# EAGLE design circuitdraft (EAGLE 9.5.2)
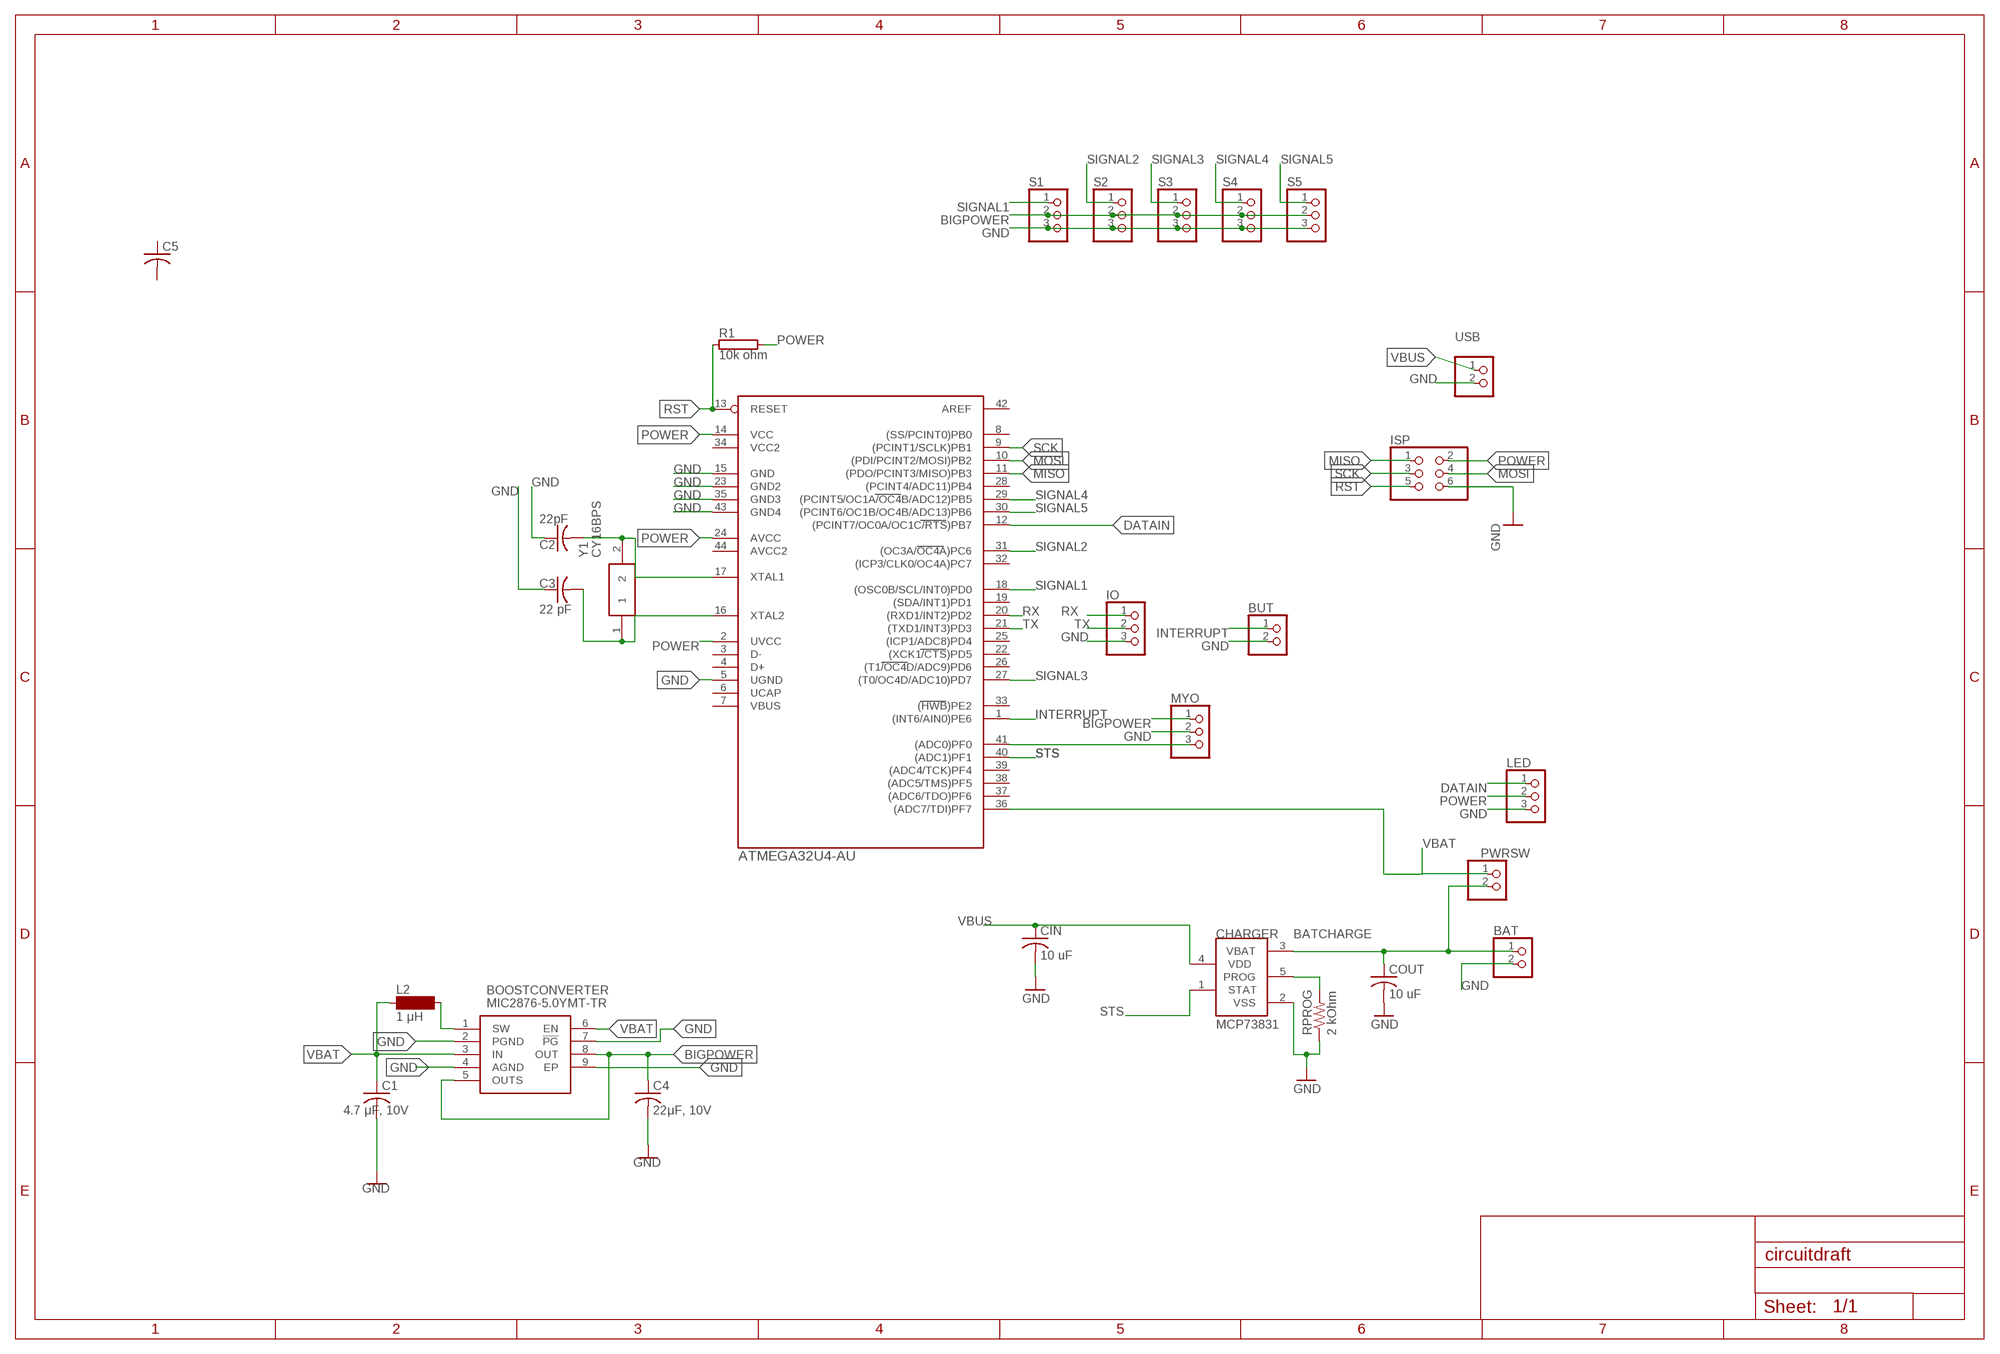
[diagram p0: schematic, sheet 1]

## Parts
BAT  PINHD-1X2  [1X02]
BOOSTCONVERTER  MIC2876-5.0YMT-TR  [MIC287650YMTTR]
BUT  PINHD-1X2  [1X02]
C1  4.7 μF, 10V  C-USC0603  [C0603]
C2  22pF  C-US025-024X044  [C025-024X044]
C3  22 pF  C-US025-024X044  [C025-024X044]
C4  22μF, 10V  C-USC0603  [C0603]
C5  C-USC0603  [C0603]
CHARGER  MCP73831  [SOT23-5L]
CIN  10 uF  C-USC0603  [C0603]
COUT  10 uF  C-USC0603  [C0603]
IO  PINHD-1X3  [1X03]
ISP  PINHD-2X3  [2X03]
L2  1 μH  SD75  [SD75]
LED  PINHD-1X3  [1X03]
MYO  PINHD-1X3  [1X03]
PWRSW  PINHD-1X2  [1X02]
R1  10k ohm  RRS1/8  [RS1/8]
RPROG  2 kOhm  R-US_R0603  [R0603]
S1  PINHD-1X3  [1X03]
S2  PINHD-1X3  [1X03]
S3  PINHD-1X3  [1X03]
S4  PINHD-1X3  [1X03]
S5  PINHD-1X3  [1X03]
U$1  ATMEGA32U4-AU  [TQFP44]
USB  PINHD-1X2  [1X02]
Y1  CY16BPS  [CY16BPS]

## Nets
BATCHARGE [power]: BAT.1 CHARGER.3(VBAT) COUT.1 PWRSW.2
BIGPOWER [power]: BOOSTCONVERTER.5(OUTS) BOOSTCONVERTER.8(OUT) C4.1 MYO.1 S1.2 S2.2 S3.2 S4.2 S5.2
DATAIN: LED.1 U$1.12((PCINT7/OC0A/OC1C/RTS)PB7)
GND: BAT.2 BOOSTCONVERTER.2(PGND) BOOSTCONVERTER.4(AGND) BOOSTCONVERTER.7(!PG) BOOSTCONVERTER.9(EP) BUT.2 C1.2 C2.1 C3.1 C4.2 CHARGER.2(VSS) CIN.2 COUT.2 IO.3 ISP.6 LED.3 MYO.2 RPROG.1 S1.3 S2.3 S3.3 S4.3 S5.3 U$1.5(UGND) U$1.15(GND) U$1.23(GND2) U$1.35(GND3) U$1.43(GND4) USB.2
INTERRUPT: BUT.1 U$1.1((INT6/AIN0)PE6)
MISO: ISP.1 U$1.11((PDO/PCINT3/MISO)PB3)
MOSI: ISP.4 U$1.10((PDI/PCINT2/MOSI)PB2)
N$1: MYO.3 U$1.41((ADC0)PF0)
N$3: BOOSTCONVERTER.1(SW) L2.2
N$4: CHARGER.5(PROG) RPROG.2
N$5: C2.2 U$1.17(XTAL1) Y1.2
N$6: C3.2 U$1.16(XTAL2) Y1.1
POWER: ISP.2 LED.2 R1.2 U$1.2(UVCC) U$1.14(VCC) U$1.24(AVCC)
RST: ISP.5 R1.1 U$1.13(RESET)
RX: IO.1 U$1.20((RXD1/INT2)PD2)
SCK: ISP.3 U$1.9((PCINT1/SCLK)PB1)
SIGNAL1: S1.1 U$1.18((OSC0B/SCL/INT0)PD0)
SIGNAL2: S2.1 U$1.31((OC3A/OC4A)PC6)
SIGNAL3: S3.1 U$1.27((T0/OC4D/ADC10)PD7)
SIGNAL4: S4.1 U$1.29((PCINT5/OC1A/OC4B/ADC12)PB5)
SIGNAL5: S5.1 U$1.30((PCINT6/OC1B/OC4B/ADC13)PB6)
STS: CHARGER.1(STAT) U$1.40((ADC1)PF1)
TX: IO.2 U$1.21((TXD1/INT3)PD3)
VBAT [power]: BOOSTCONVERTER.3(IN) BOOSTCONVERTER.6(EN) C1.1 L2.1 PWRSW.1 U$1.36((ADC7/TDI)PF7)
VBUS: CHARGER.4(VDD) CIN.1 USB.1
Unconnected: C5.1 C5.2 U$1.3(D-) U$1.4(D+) U$1.6(UCAP) U$1.7(VBUS) U$1.8((SS/PCINT0)PB0) U$1.19((SDA/INT1)PD1) U$1.22((XCK1/CTS)PD5) U$1.25((ICP1/ADC8)PD4) U$1.26((T1/OC4D/ADC9)PD6) U$1.28((PCINT4/ADC11)PB4) U$1.32((ICP3/CLK0/OC4A)PC7) U$1.33((HWB)PE2) U$1.34(VCC2) U$1.37((ADC6/TDO)PF6) U$1.38((ADC5/TMS)PF5) U$1.39((ADC4/TCK)PF4) U$1.42(AREF) U$1.44(AVCC2)

## Library data of the parts
BAT BUT PWRSW USB = pinhead:PINHD-1X2: PIN HEADER
BOOSTCONVERTER = 3DPC:MIC2876-5.0YMT-TR: Switching Voltage Regulators Source: Datasheet <https://componentsearchengine.com/Datasheets/1/MIC2876-5.0YMT-TR.pdf>; DESCRIPTION: Switching Voltage Regulators; HEIGHT: 0.6mm; MANUFACTURER_NAME: Microchip; MANUFACTURER_PART_NUMBER: MIC2876-5.0YMT-TR; MOUSER_PART_NUMBER: 998-MIC2876-50YMTTR; MOUSER_PRICE-STOCK: https://www.mouser.com/Search/Refine.aspx?Keyword=998-MIC2876-50YMTTR
C1 C4 C5 CIN COUT = 3DPC:C-US: CAPACITOR, American symbol; SPICEPREFIX: C
C2 C3 = rcl:C-US: CAPACITOR, American symbol; SPICEPREFIX: C
CHARGER = 3DPC:MCP73831: Miniature Single-Cell, Fully Integrated Li-Ion, Li-Polymer Charge Management Controllers
IO LED MYO S1-S5 = pinhead:PINHD-1X3: PIN HEADER
ISP = pinhead:PINHD-2X3: PIN HEADER
L2 = inductor-neosid:SD75: INDUCTOR nominal inductance, E12; OC_FARNELL: unknown; OC_NEWARK: unknown
R1 = resistor-power:R: Power Resitor; OC_FARNELL: unknown; OC_NEWARK: unknown
RPROG = 3DPC:R-US_: RESISTOR, American symbol; SPICEPREFIX: R
U$1 = mega32U4:ATMEGA32U4-AU
Y1 = SamacSys_Parts:CY16BPS: Crystals 16MHz 20pF 0C +70C Source: Datasheet <https://componentsearchengine.com/Datasheets/1/CY16BPS.pdf>; DESCRIPTION: Crystals 16MHz 20pF 0C +70C; HEIGHT: 5mm; MANUFACTURER_NAME: Crystek; MANUFACTURER_PART_NUMBER: CY16BPS; MOUSER_PART_NUMBER: 549-CY16BPS; MOUSER_PRICE-STOCK: https://www.mouser.com/Search/Refine.aspx?Keyword=549-CY16BPS

## Net classes
1 power: width 0.1 mm

## Board
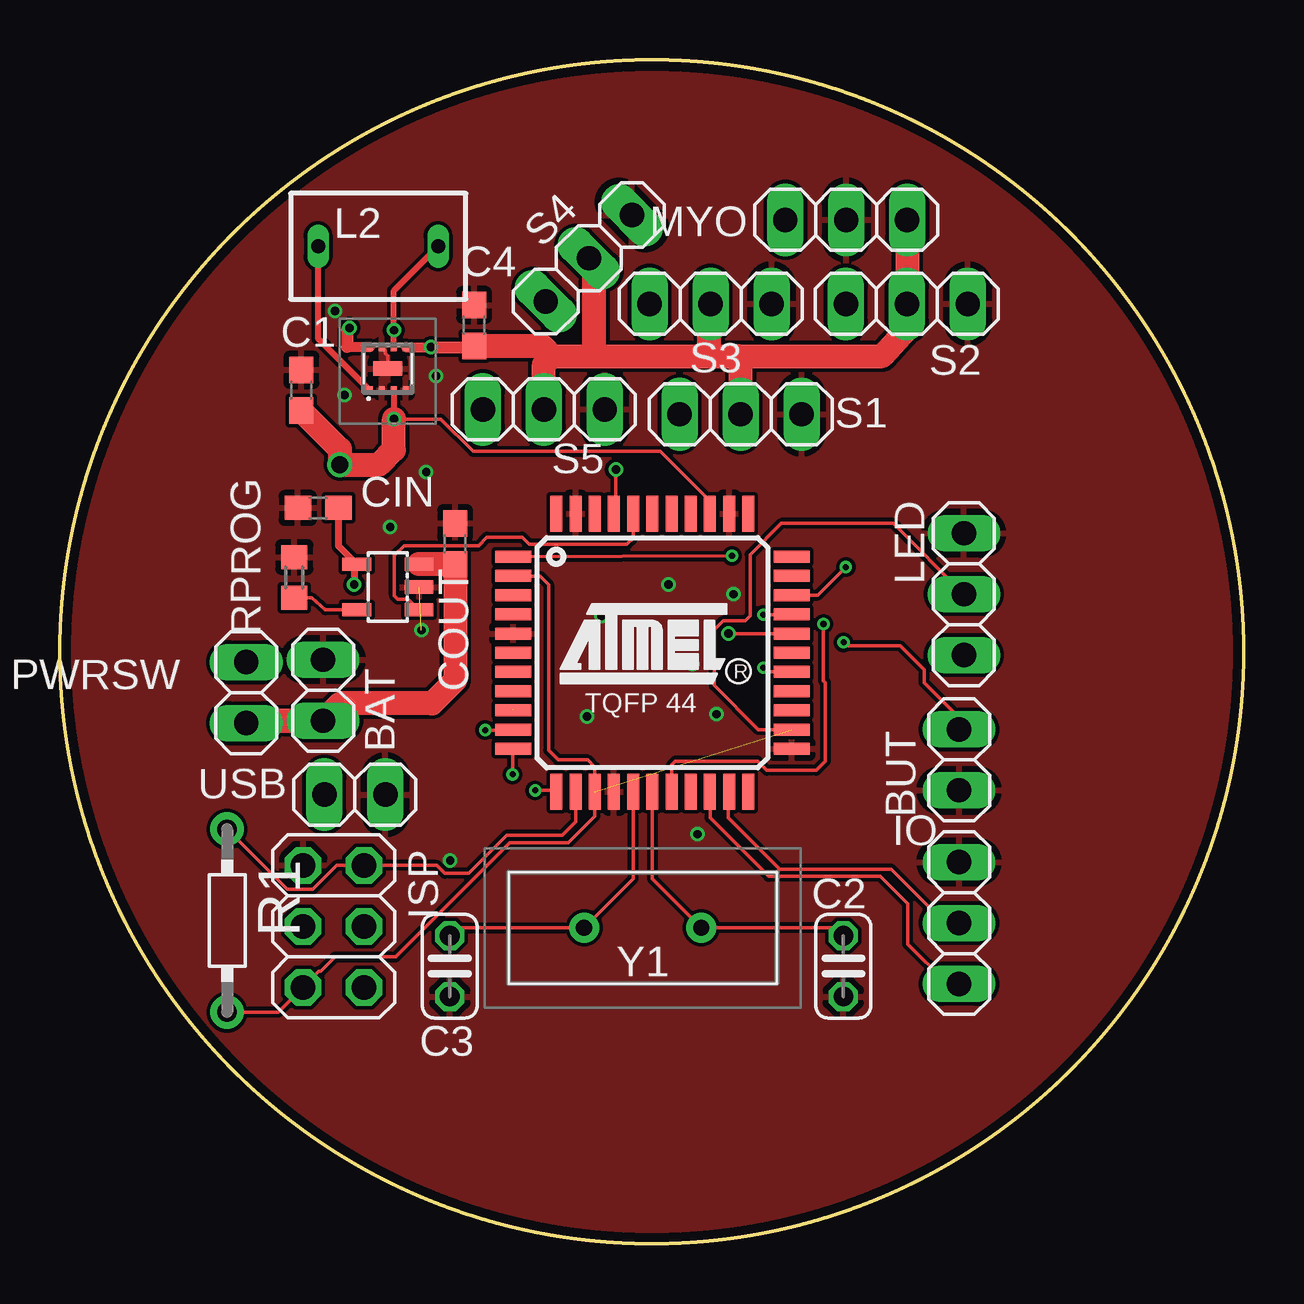
[diagram p1: board, top side]
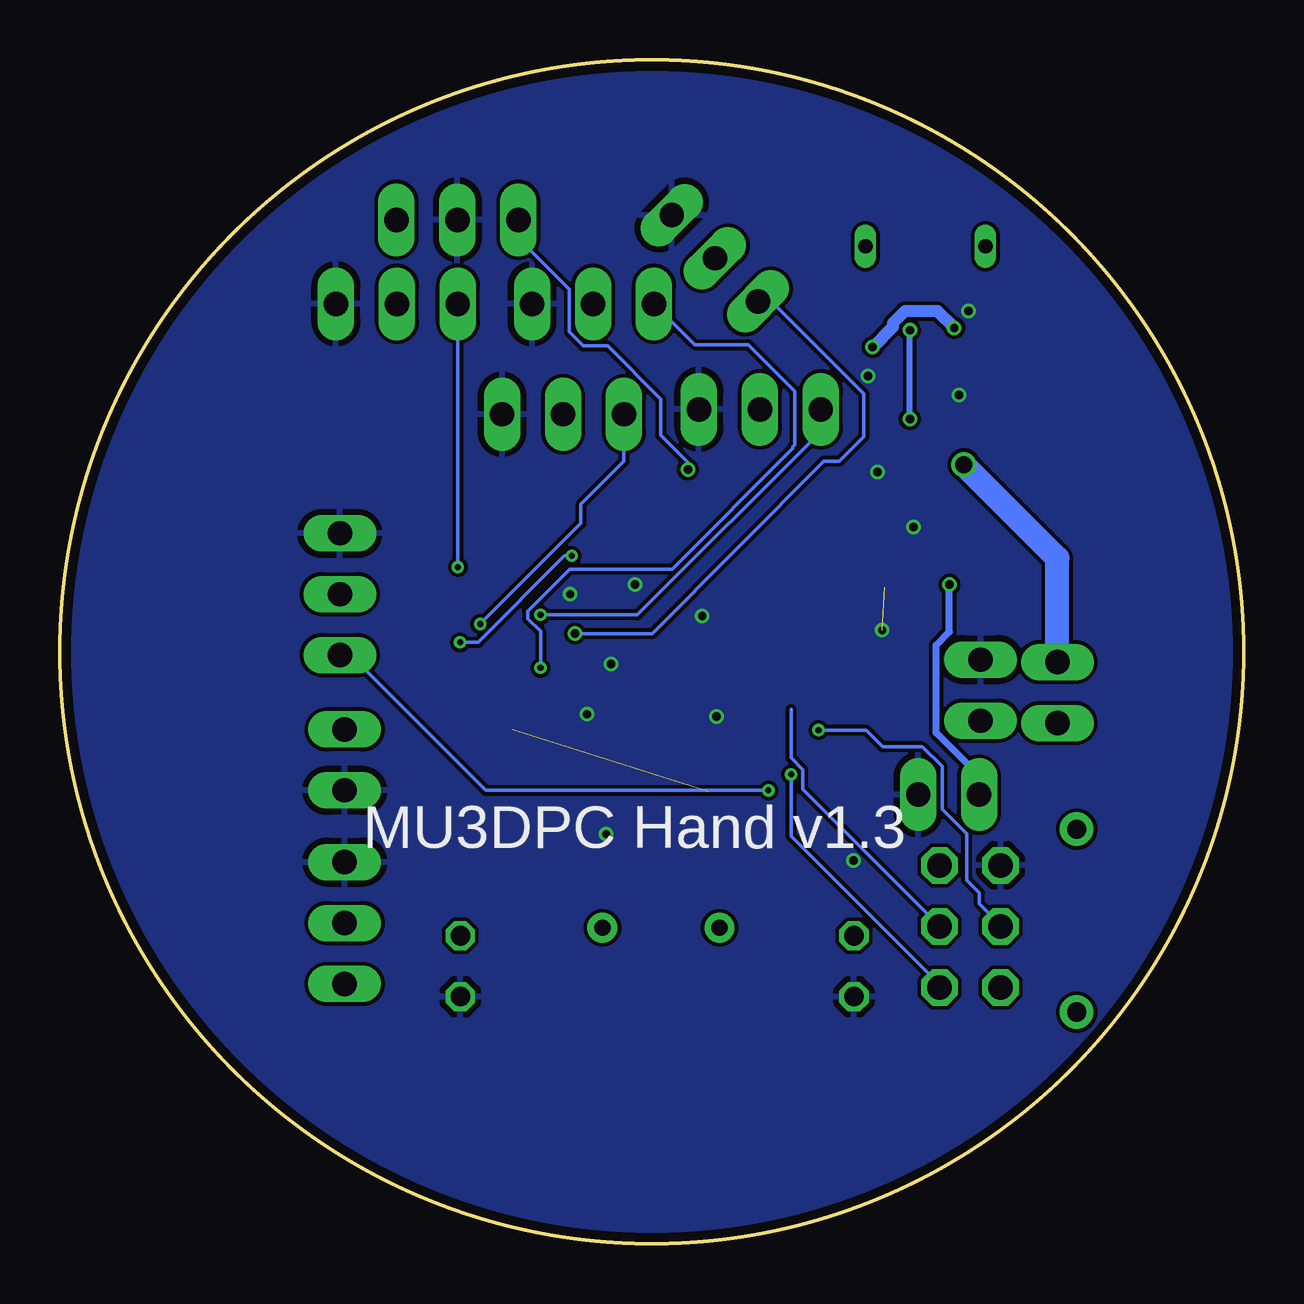
[diagram p2: board, bottom side, seen from below]

Size 49.32 x 49.32 mm. Coordinates in mm from the lower left corner, seen from the top.
Outline: circle at 24.66,24.66 radius 24.66
Copper layers (1*16): Top 0.035559375mm / dielectric 1.6mm / Bottom 0.035559375mm
Design rules "oshpark-2layer *": minimum track width 6mil, minimum drill 10mil, track to track 6mil, track to pad 6mil, pad to pad 6mil, via to via 6mil, smd to smd 6mil, copper to edge 15mil, drill to drill 6mil, minimum pad ring 5mil, minimum via ring 5mil, stop-mask expansion 2.5mil, vias tented up to drill 30mil, thermal gap 10mil

### Footprints (pad centres in the part's own frame; a part is rotated, then mirrored left to right if it is on the bottom)
1X02 = drill 1.016 long: 1 -1.27,0; 2 1.27,0
MIC287650YMTTR = smd 0.25 x 0.35: 1 -0.75,-0.9; 2 -0.25,-0.9; 3 0.25,-0.9; 4 0.75,-0.9; 5 0.75,0.9; 6 0.25,0.9; 7 -0.25,0.9; 8 -0.75,0.9 | smd 1.2 x 0.6: 9 0,0
C0603 = smd 1.1 x 1: 1 -0.85,0; 2 0.85,0
C025-024X044 = drill 0.813 octagon: 1 -1.27,0; 2 1.27,0
SOT23-5L = smd 0.55 x 1.2: 1 -0.95,-1.3; 2 0,-1.3; 3 0.95,-1.3; 4 0.95,1.3; 5 -0.95,1.3
1X03 = drill 1.016 long: 1 -2.54,0; 2 0,0; 3 2.54,0
2X03 = drill 1.016 octagon: 1 -2.54,-1.27; 2 -2.54,1.27; 3 0,-1.27; 4 0,1.27; 5 2.54,-1.27; 6 2.54,1.27
SD75 = drill 0.6 long: 1 -2.5,0; 2 2.5,0
RS1/8 = drill 0.8 pad 1.4: 1 -3.81,0; 2 3.81,0
R0603 = smd 1 x 1.1: 1 -0.85,0; 2 0.85,0
TQFP44 = smd 1.5 x 0.5: 1 -5.8,4; 2 -5.8,3.2; 3 -5.8,2.4; 4 -5.8,1.6; 5 -5.8,0.8; 6 -5.8,0; 7 -5.8,-0.8; 8 -5.8,-1.6; 9 -5.8,-2.4; 10 -5.8,-3.2; 11 -5.8,-4; 23 5.8,-4; 24 5.8,-3.2; 25 5.8,-2.4; 26 5.8,-1.6; 27 5.8,-0.8; 28 5.8,0; 29 5.8,0.8; 30 5.8,1.6; 31 5.8,2.4; 32 5.8,3.2; 33 5.8,4 | smd 0.5 x 1.5: 12 -4,-5.8; 13 -3.2,-5.8; 14 -2.4,-5.8; 15 -1.6,-5.8; 16 -0.8,-5.8; 17 0,-5.8; 18 0.8,-5.8; 19 1.6,-5.8; 20 2.4,-5.8; 21 3.2,-5.8; 22 4,-5.8; 34 4,5.8; 35 3.2,5.8; 36 2.4,5.8; 37 1.6,5.8; 38 0.8,5.8; 39 0,5.8; 40 -0.8,5.8; 41 -1.6,5.8; 42 -2.4,5.8; 43 -3.2,5.8; 44 -4,5.8
CY16BPS = drill 0.68 pad 1.247: 1 -2.44,0; 2 2.44,0

### Placement (x,y rotation side)
BAT  10.96,23.06 90 top
BOOSTCONVERTER  13.66,36.46 0 top
BUT  37.46,20.16 270 top
C1  10.06,35.56 90 top
C2  32.64,11.56 90 top
C3  16.24,11.56 90 top
C4  17.26,38.26 90 top
C5  -4.54,-3.24 0 top  (outside the outline)
CHARGER  13.66,27.36 90 top
CIN  10.76,30.66 180 top
COUT  16.46,29.16 90 top
IO  37.46,13.36 90 top
ISP  11.4,13.22 90 top
L2  13.26,41.56 180 top
LED  37.66,27.06 90 top
MYO  32.76,42.66 180 top
PWRSW  7.76,22.96 270 top
R1  6.96,13.46 270 top
RPROG  9.76,27.76 270 top
S1  28.36,34.56 0 top
S2  35.28,39.16 0 top
S3  27.11,39.16 0 top
S4  22.03,41.06 45 top
S5  20.16,34.76 0 top
U$1  24.68,24.62 0 top
USB  12.29,18.71 0 top
Y1  24.28,13.16 0 top

### Tracks (layer width: path | path; a pad name or v marks a point on that pad's centre or on a via)
BATCHARGE
  Top 1: CHARGER.3 COUT.1 16.46,23.47 15.51,22.52 11.69,22.52 BAT.1
  Top 1.016: BAT.1 7.86,21.79 PWRSW.2
BIGPOWER  (via drill 0.35)
  Top 0.152: 17.23,37.38 C4.1
  Top 0.406: BOOSTCONVERTER.8 11.96,37.36 | BOOSTCONVERTER.5 v15.46,37.36
  Top 0.508: v12.06,38.16 11.96,38.06 11.96,37.36 | v15.46,37.36 17.21,37.36 17.23,37.38
  Top 1: 28.26,36.98 34.26,36.98 35.28,38.11 S2.2 35.31,39.09 35.31,42.65 MYO.1 | C4.1 20.09,37.41 20.52,36.98 | 20.52,36.98 22.26,36.98 | 22.26,36.98 27.06,36.98 | 27.06,36.98 28.26,36.98 | S5.2 20.16,36.62 20.52,36.98 | S1.2 28.36,36.88 28.26,36.98 | 27.06,36.98 27.06,39.11 S3.2 | 22.26,36.98 22.26,40.83 S4.2
  Bottom 0.508: v12.06,38.16 12.76,38.86 14.11,38.86 14.62,38.35 14.62,38.2 v15.46,37.36
DATAIN  (via drill 0.25)
  Top 0.152: v19.8,18.88 20.61,18.88 U$1.12
  Bottom 0.152: v19.8,18.88 31.58,18.88 37.15,24.45 37.6,24.45 LED.1
GND  (via drill 0.35)  (1 unrouted)
  Top 0.152: BOOSTCONVERTER.7 13.55,37.22 13.55,37.09 13.66,36.99 BOOSTCONVERTER.9
  other vias: 28.06,27.06 25.36,27.46 21.96,21.96 15.26,32.16 13.76,29.86 15.06,25.56 16.26,15.96 26.56,17.06 26.36,24.16 27.36,22.06 22.56,26.16 11.46,38.86 11.86,35.36 15.66,36.16
  pour Top: -3.74,64.96 51.36,64.96 51.36,-0.64 -3.74,-0.64
  pour Bottom: -5.94,67.66 50.46,67.66 50.46,-1.24 -5.94,-1.24
INTERRUPT  (via drill 0.25)
  Top 0.152: v32.65,25.06 32.8,24.9 35.01,24.9 36,23.91 36,23.38 37.45,21.93 37.45,21.48 BUT.1 | v28,28.66 27.98,28.66 U$1.1
  Bottom 0.152: v28,28.66 28.31,28.66 31.89,25.06 v32.65,25.06
MISO  (via drill 0.25)
  Top 0.152: v18.86,19.55 18.86,20.56 U$1.11
  Bottom 0.152: v18.86,19.55 18.86,16.98 12.61,10.73 ISP.1
MOSI  (via drill 0.25)
  Top 0.152: v17.71,21.4 18.86,21.4 U$1.10
  Bottom 0.152: ISP.4 10.09,13.25 11.01,14.16 11.01,14.62 11.54,15.15 11.54,17.07 12.57,18.1 12.57,19.88 13.39,20.7 15.03,20.7 15.73,21.4 v17.71,21.4
N$1  (via drill 0.35)
  Top 0.152: U$1.41 23.05,30.47 23.16,30.58 v23.16,32.26
  Bottom 0.152: MYO.3 30.22,41.89 28.1,39.77 28.1,37.99 27.52,37.41 26.5,37.41 24.29,35.19 24.29,33.69 23.16,32.56 v23.16,32.26
N$3
  Top 0.254: BOOSTCONVERTER.1 10.76,37.71 L2.2
N$4
  Top 0.152: CHARGER.5 11.06,26.41 10.48,26.91 RPROG.2
N$5
  Top 0.152: U$1.17 24.68,15.2 Y1.2 32.31,13.16 C2.2
N$6
  Top 0.152: C3.2 16.57,13.16 Y1.1 23.88,15.2 U$1.16
POWER  (1 unrouted)
  Top 0.152: U$1.2 18.93,27.8 20.02,27.8 20.36,27.46 20.36,20.56 20.76,20.16 21.99,20.16 22.29,19.86 22.29,18.88 U$1.14 22.29,18.81 22.29,17.82 21.18,16.71 18.74,16.71 13.98,11.95 11.47,11.95 10.86,11.34 10.78,11.34 10.17,10.73 ISP.2 9.1,9.65 R1.2 | LED.2 34.71,30.01 30.06,30.01 28.76,28.71 28.76,26.16 28.55,25.95 27.64,25.95 27.26,25.57 27.26,23.26 29.1,21.42 U$1.24
RST
  Top 0.152: U$1.13 21.48,17.58 20.92,17.02 18.62,17.02 17.03,15.43 16.04,15.43 15.71,15.76 12.69,15.76 ISP.5 11.53,15.76 10.54,14.77 9.46,14.77 R1.1
RX
  Top 0.152: U$1.20 27.09,18.81 27.09,17.74 29.53,15.3 34.17,15.3 35.32,14.16 35.32,12.48 36.92,10.88 37.45,10.88 IO.1
SCK  (1 unrouted)
  Top 0.152: 18.86,22.24 U$1.9
  Bottom 0.152: 18.86,22.26 18.86,20.24 18.37,19.75 18.37,18.92 ISP.3
SIGNAL1  (via drill 0.25)
  Top 0.152: v31.81,25.82 31.81,23.46 31.89,23.38 31.89,20.1 31.51,19.72 29.45,19.72 29.07,20.1 25.64,20.1 25.49,19.95 25.49,18.88 U$1.18
  Bottom 0.152: v31.81,25.82 27.62,30.01 27.62,30.8 25.82,32.6 S1.1
SIGNAL2  (via drill 0.25)
  Top 0.152: U$1.31 31.57,27.02 v32.74,28.19
  Bottom 0.152: S2.1 v32.74,28.19
SIGNAL3  (via drill 0.25)
  Top 0.152: v29.3,23.99 29.45,23.84 30.44,23.84 U$1.27
  Bottom 0.152: v29.3,23.99 29.3,25.51 29.83,26.05 29.83,26.35 28.08,28.11 23.81,28.11 18.78,33.13 18.78,33.21 18.71,33.29 18.71,35.52 20.64,37.46 22.87,37.46 S3.1
SIGNAL4  (via drill 0.35)
  Top 0.152: U$1.29 v27.86,25.42
  Bottom 0.152: S4.1 19.68,39.26 15.82,35.41 15.82,33.62 16.85,32.6 17.49,32.6 24.65,25.42 v27.86,25.42
SIGNAL5  (via drill 0.25)
  Top 0.152: v29.3,26.2 30.44,26.2 U$1.30
  Bottom 0.152: v29.3,26.2 25.26,26.2 17.56,33.9 17.56,34.75 S5.1
STS
  Top 0.152: U$1.40 23.88,29.4 23.62,29.14 19.56,29.14 19.26,29.44 17.79,29.44 17.44,29.09 14.34,29.09 13.93,28.68 13.93,26.99 14.06,26.86 14.51,26.86 CHARGER.1
TX
  Top 0.152: U$1.21 27.85,18.81 27.85,17.74 29.98,15.61 34.63,15.61 36.84,13.4 37.45,13.4 IO.2
VBAT  (via drill 0.35, 0.7 pad 1)
  Top 0.152: U$1.36 27.08,30.94 26.76,31.26 25.02,33.01 17.21,33.01 15.86,34.36 v13.91,34.36
  Top 0.254: BOOSTCONVERTER.3 v13.91,34.36 | BOOSTCONVERTER.6 v13.91,38.06 13.91,39.71 L2.1
  Top 1: C1.1 11.66,33.11 v11.66,32.46 13.3,32.46 13.91,33.07 v13.91,34.36
  Bottom 0.254: v13.91,34.36 v13.91,38.06
  Bottom 1: PWRSW.1 7.76,28.56 v11.66,32.46
VBUS  (via drill 0.35)
  Top 0.152: CHARGER.4 12.26,28.21
  Top 0.3: CHARGER.4 11.61,29.06 CIN.1 | 12.26,28.21 v12.26,27.46
  Bottom 0.3: USB.1 11.02,19.49 12.81,21.28 12.81,24.94 12.26,25.49 v12.26,27.46

### Text on the board
bPlace: MU3DPC Hand v1.3